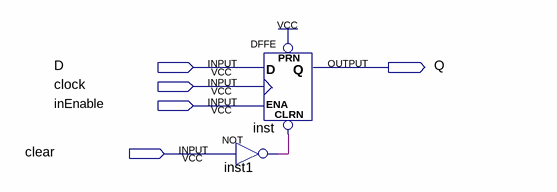
[diagram p0: schematic sheet]
// Quartus schematic DflipflopE.bdf as structural Verilog: 2 symbols, 5 pins
module DflipflopE (
  input  D,
  input  clock,
  input  inEnable,
  input  clear,
  output Q
);

  wire inst1_out;

  DFFE inst (.PRN(1'b1), .CLRN(inst1_out), .D(D), .CLK(clock), .ENA(inEnable), .Q(Q));
  not inst1 (inst1_out, clear);
endmodule
